# EAGLE design AK9753 Human Movement Sensor (EAGLE 7.7.0)
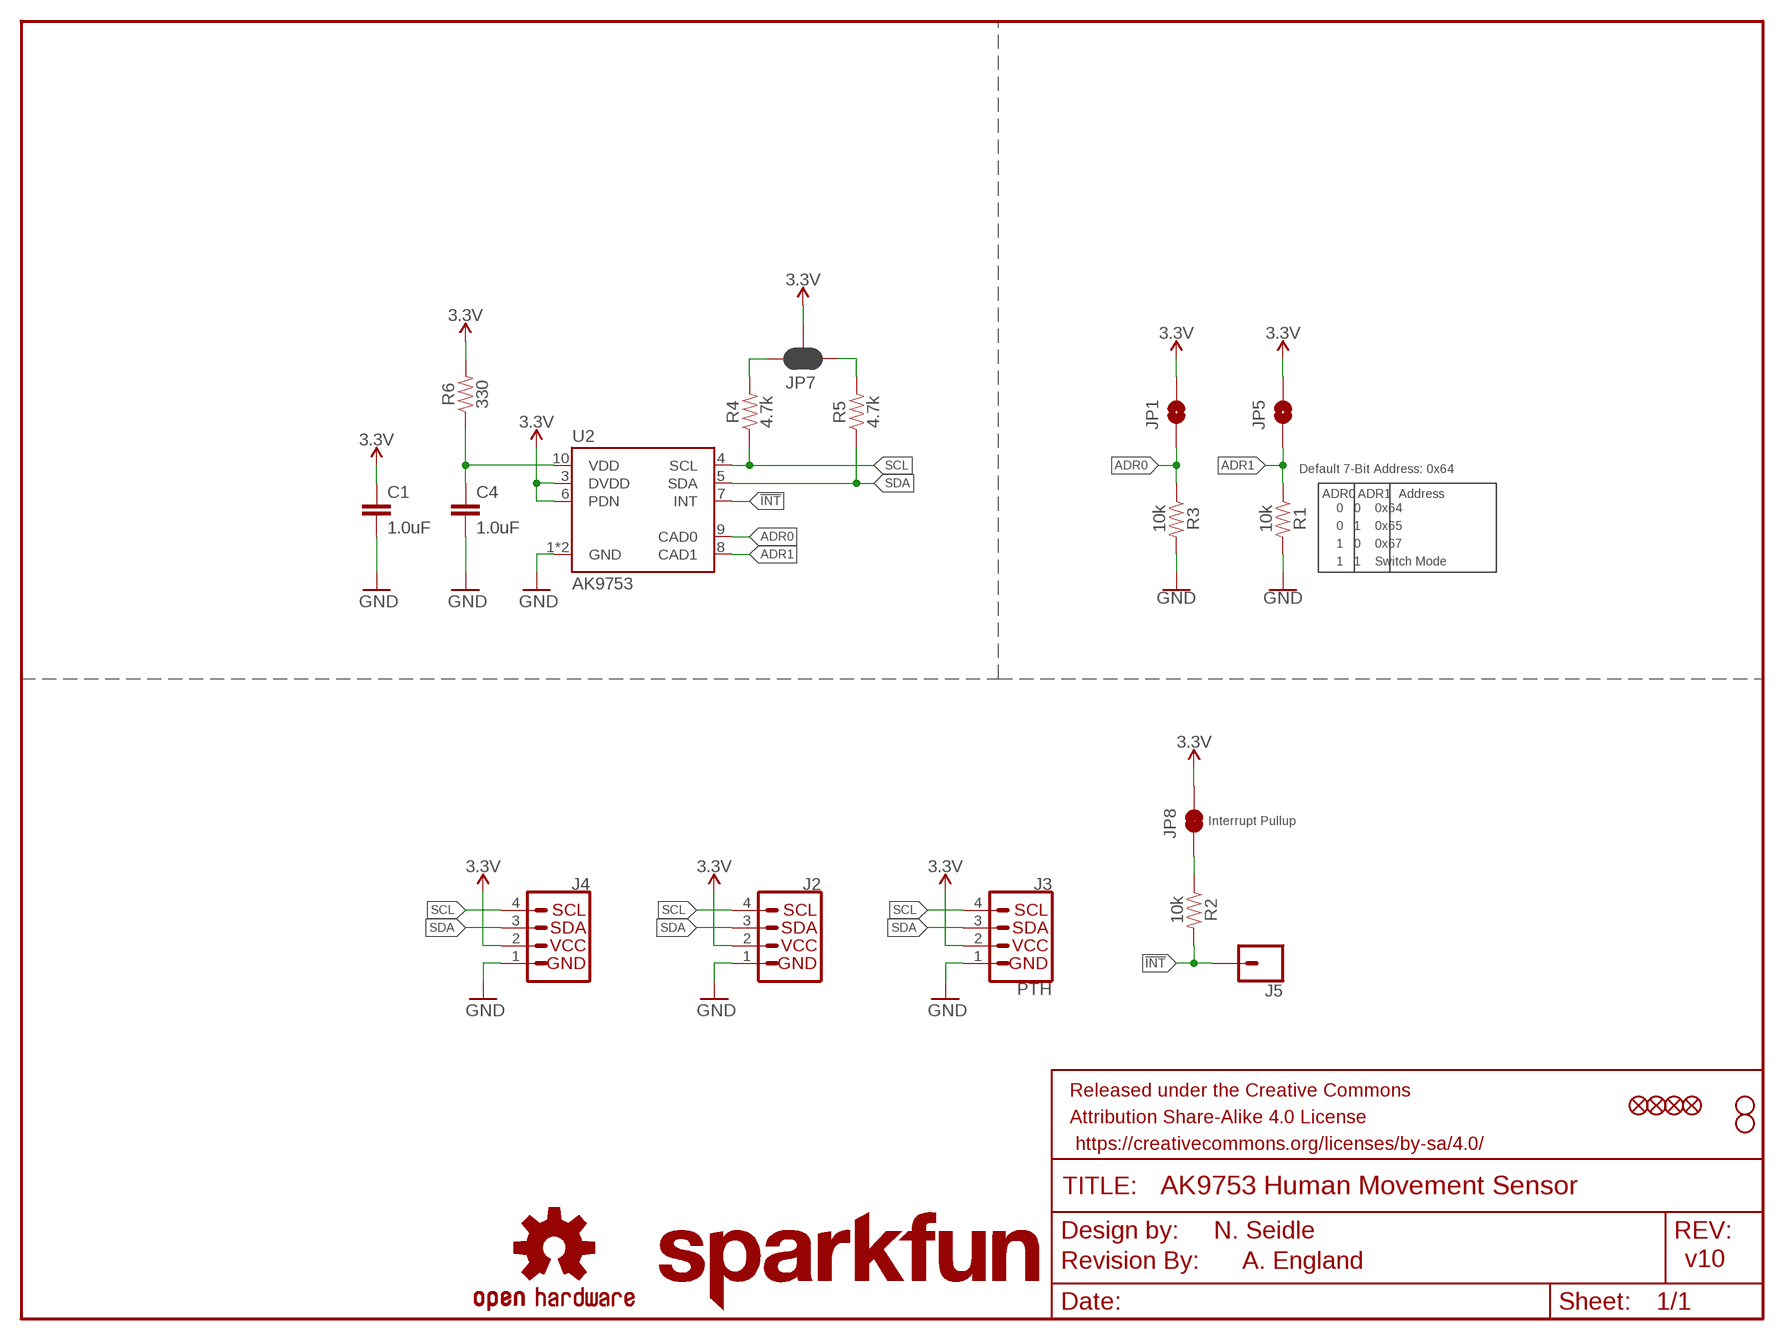
[diagram p0: schematic, sheet 1]

## Parts
C1  1.0uF  1.0UF-0603-16V-10%  [0603]
C4  1.0uF  1.0UF-0603-16V-10%  [0603]
FRAME1  FRAME-LETTER  [CREATIVE_COMMONS]
J2  QWIIC_CONNECTORJS-1MM  [1X04_1MM_RA]
J3  PTH  I2C_STANDARD_NO_SILK  [1X04_NO_SILK]
J4  QWIIC_CONNECTORJS-1MM  [1X04_1MM_RA]
J5  CONN_01PTH_NO_SILK_YES_STOP  [1X01_NO_SILK]
JP1  JUMPER-SMT_2_NO_SILK  [SMT-JUMPER_2_NO_SILK]
JP2  FIDUCIALUFIDUCIAL  [MICRO-FIDUCIAL]
JP3  STAND-OFF  [STAND-OFF]
JP4  STAND-OFF  [STAND-OFF]
JP5  JUMPER-SMT_2_NO_SILK  [SMT-JUMPER_2_NO_SILK]
JP6  FIDUCIALUFIDUCIAL  [MICRO-FIDUCIAL]
JP7  JUMPER-SMT_3_2-NC_PASTE_SILK  [SMT-JUMPER_3_2-NC_PASTE_SILK]
JP8  JUMPER-SMT_2_NC_TRACE_SILK  [SMT-JUMPER_2_NC_TRACE_SILK]
JP9  FIDUCIALUFIDUCIAL  [MICRO-FIDUCIAL]
JP10  FIDUCIALUFIDUCIAL  [MICRO-FIDUCIAL]
LOGO1  OSHW-LOGOMINI  [OSHW-LOGO-MINI]
LOGO2  SFE_LOGO_NAME.1_INCH  [SFE_LOGO_NAME_.1]
LOGO3  REVISION  [REVISION]
R1  10k  10KOHM-0603-1/10W-1%  [0603]
R2  10k  10KOHM-0603-1/10W-1%  [0603]
R3  10k  10KOHM-0603-1/10W-1%  [0603]
R4  4.7k  4.7KOHM-0603-1/10W-1%  [0603]
R5  4.7k  4.7KOHM-0603-1/10W-1%  [0603]
R6  330  330OHM-0603-1/10W-1%  [0603]
U2  AK9753  AK9750"  [SON10]

## Nets
3.3V: C1.1 J2.2 J3.2 J4.2 JP1.2 JP5.2 JP7.2 JP8.2 R6.2 U2.3(DVDD) U2.6(PDN)
!INT: J5.1 R2.2 U2.7(INT)
ADR0: JP1.1 R3.1 U2.9(CAD0)
ADR1: JP5.1 R1.1 U2.8(CAD1)
GND: C1.2 C4.2 J2.1 J3.1 J4.1 R1.2 R3.2 U2.1(GND) U2.2(GND)
N$1: JP7.1 R5.2
N$2: JP7.3 R4.2
N$3: JP8.1 R2.1
SCL: J2.4 J3.4 J4.4 R4.1 U2.4(SCL)
SDA: J2.3 J3.3 J4.3 R5.1 U2.5(SDA)
VDD: C4.1 R6.1 U2.10(VDD)

## Notes on the sheet
- Default 7-Bit Address: 0x64
- ADR0 | ADR1 | Address
- 0   0    0x64
- 0   1    0x65
- 1   0    0x67
- 1   1    Switch Mode
- Interrupt Pullup
- N. Seidle
- A. England | v10

## Library data of the parts
C1 C4 = SparkFun-Capacitors:1.0UF: 1µF ceramic capacitors A capacitor is a passive two-terminal electrical component used to store electrical energy temporarily in an electric field.; PROD_ID: CAP-00868
FRAME1 = SparkFun-Aesthetics:FRAME-LETTER: Schematic Frame - Letter Standard 8.5x11 US Letter frame
J2 J4 = SparkFun-Connectors:QWIIC_CONNECTOR: SparkFun I2C Standard Qwiic Connector An SMD 1mm pitch JST connector makes it easy and quick (get it? Qwiic?) to connect I2C devices to each other. The Qwiic system <http://www.sparkfun.com/qwiic> enables fast and solderless connection between popular platforms and various sensors and actuators. We carry 200mm <https://www.sparkfun.com/products/14204>, 100mm <https://www.sparkfun.com/products/14205>, 50mm <https://www.sparkfun.com/products/14206>, and breadboard friendly <https://www.sparkfun.com/products/14207> Qwiic cables. We also offer 10 pcs strips <https://www.sparkfun.com/products/14323> the SMD connectors.; PROD_ID: CONN-13694
J3 = SparkFun-Connectors:I2C_STANDARD: SparkFun I2C Standard Pinout Header SparkFun has standardized on a pinout for all I2C based sensor breakouts. This pinout allows I2C boards to be plugged directly into the headers on Arduino Uno compatible boards, and to be daisy chained easily. Example SparkFun Products: SparkFun Atmospheric Sensor Breakout - BME280 <https://www.sparkfun.com/products/13676> SparkFun Altitude/Pressure Sensor Breakout - MPL3115A2 <https://www.sparkfun.com/products/11084> SparkFun TOF Range Finder Sensor - VL6180 <https://www.sparkfun.com/products/12785>
J5 = SparkFun-Connectors:CONN_01: Single connection point. Often used as Generic Header-pin footprint for 0.1 inch spaced/style header connections On any of the 0.1 inch spaced packages, you can populate with these: Break Away Headers - Straight <https://www.sparkfun.com/products/116> (PRT-00116) Break Away Male Headers - Right Angle <https://www.sparkfun.com/products/553> (PRT-00553) Female Headers <https://www.sparkfun.com/products/115> (PRT-00115) Break Away Headers - Machine Pin <https://www.sparkfun.com/products/117> (PRT-00117) Break Away Female Headers - Swiss Machine Pin <https://www.sparkfun.com/products/743> (PRT-00743) This device is also useful as a general connection point to wire up your design to another part of your project. Our various solder wires solder well into these plated through hole pads. Hook-Up Wire - Assortment (Stranded, 22 AWG) <https://www.sparkfun.com/products/11375> (PRT-11375) Hook-Up Wire - Assortment (Solid Core, 22 AWG) <https://www.sparkfun.com/products/11367> (PRT-11367) View the entire wire category on our website here <https://www.sparkfun.com/categories/141> Special notes: SMTSO-256-ET is a "flush mount" nut for a 4-40 screw. We mostly use this on specialty testbeds; it is a nice way to connect hardware to your PCB at an adjustable hieght. Also note, the SNAP packages are for using a snappable style connector. We sell a baggie of snaps and they are also used on two LilyPad designs: Snap Assortment - 30 pack (male and female) <https://www.sparkfun.com/products/11347> (DEV-11347) LilyPad Arduino SimpleSnap <https://www.sparkfun.com/products/10941> (DEV-10941) LilyPad SimpleSnap Protoboard <https://www.sparkfun.com/products/10940> (DEV-10940)
JP1 JP5 = SparkFun-Jumpers:JUMPER-SMT_2_NO: Normally open jumper This jumper has two pads in close proximity to each other. Apply solder to close the connection. Round pads are easier to solder for beginners, but are a lot larger. SparkFun Product that uses the round pads: SparkFun EL Sequencer <https://www.sparkfun.com/products/12781>
JP2 JP6 JP9 JP10 = SparkFun:FIDUCIAL: Fiducial Alignment Points Various fiducial points for machine vision alignment.
JP3 JP4 = SparkFun:STAND-OFF: Stand Off This is the mechanical footprint for a #4 phillips button head screw. Use the keepout ring to avoid running the screw head into surrounding components. SKU : PRT-00447
JP7 = SparkFun-Jumpers:JUMPER-SMT_3_2-NC_PASTE: Normally closed solder jumper (2 of 2 connections) This jumper has an aperture in the stencil to allow solder paste to bridge both connections. Both connections are normally closed (NC). Wick off the solder to open the connection(s). Reapply solder to reclose the connection(s).
JP8 = SparkFun-Jumpers:JUMPER-SMT_2_NC_TRACE: Normally closed trace jumper This jumper has a trace between two pads so it's normally closed (NC). Use a razor knife to open the connection. For best results follow the IPC guidelines for cutting traces: Cutout at least 0.063 mm (0.005 in). Remove all loose material to clean up the cut area. Seal the cut with an approved epoxy. Reapply solder to reclose the connection.
LOGO1 = SparkFun-Aesthetics:OSHW-LOGO: Open-Source Hardware (OSHW) Logo This logo indicates the piece of hardware it is found on incorporates a OSHW license and/or adheres to the definition of open source hardware found here: http://freedomdefined.org/OSHW
LOGO2 = SparkFun-Aesthetics:SFE_LOGO_NAME: SparkFun Font Logo This is the SparkFun name logo. The logo on the schematic will always be the same size; the package variant is the height of the flame part of the logo (or the height the flame would be, if it were drawn). Default layer for the logo on the board is tSilk.
LOGO3 = SparkFun-Aesthetics:REVISION: "Revision By" Text Preceding text for revisor documentation. Includes schematic text on "symbols" layer, and board text on tDoc.
R1-R3 = SparkFun-Resistors:10KOHM: 10kΩ resistor A resistor is a passive two-terminal electrical component that implements electrical resistance as a circuit element. Resistors act to reduce current flow, and, at the same time, act to lower voltage levels within circuits. - Wikipedia; PROD_ID: RES-00824
R4 R5 = SparkFun-Resistors:4.7KOHM: 4.7kΩ resistor A resistor is a passive two-terminal electrical component that implements electrical resistance as a circuit element. Resistors act to reduce current flow, and, at the same time, act to lower voltage levels within circuits. - Wikipedia; PROD_ID: RES-07857
R6 = SparkFun-Resistors:330OHM: 330Ω resistor A resistor is a passive two-terminal electrical component that implements electrical resistance as a circuit element. Resistors act to reduce current flow, and, at the same time, act to lower voltage levels within circuits. - Wikipedia; PROD_ID: RES-00818
U2 = SparkFun-Sensors:AK9750: AK9750/AK9753 Human Movement Sensor; PROD_ID: SEN_13772

## Board
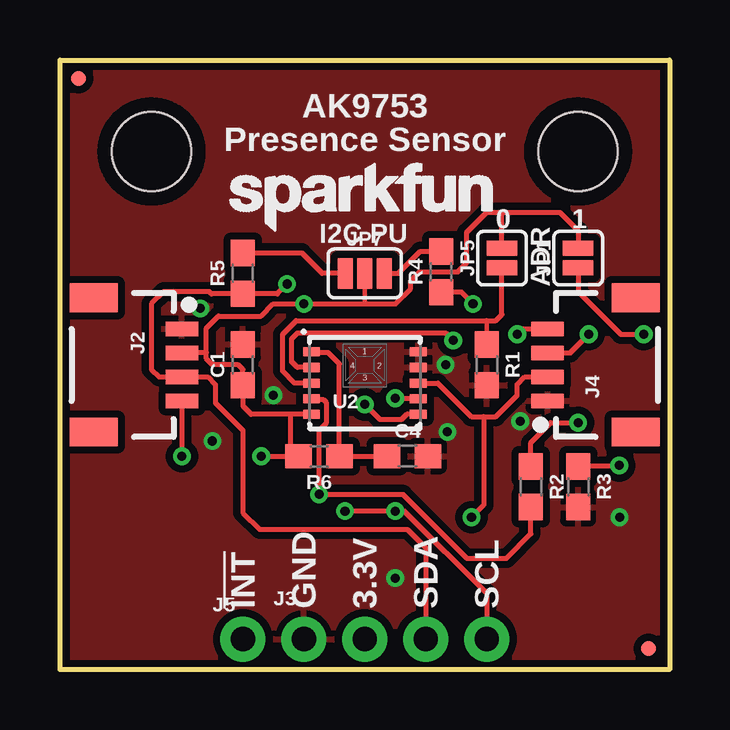
[diagram p1: board, top side]
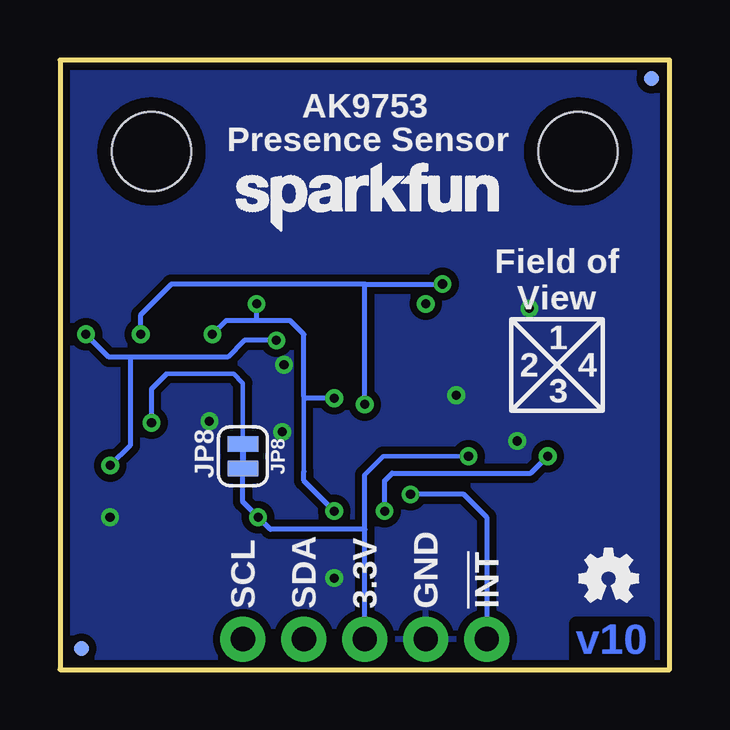
[diagram p2: board, bottom side, seen from below]

Size 25.4 x 25.4 mm. Coordinates in mm from the lower left corner, seen from the top.
Outline: 0,0 0,25.4 25.4,25.4 25.4,0 0,0
Copper layers (1*16): Top 0.035mm / dielectric 1.5mm / Bottom 0.035mm
Design rules "SparkFun-2-layer-TIGHT": minimum track width 7mil, minimum drill 15mil, track to track 7mil, track to pad 7mil, pad to pad 7mil, via to via 7mil, smd to smd 7mil, copper to edge 7mil, drill to drill 7mil, minimum pad ring 7mil, minimum via ring 7mil, stop-mask expansion 4mil, vias tented up to drill 25mil, thermal gap 10mil

### Footprints (pad centres in the part's own frame; a part is rotated, then mirrored left to right if it is on the bottom)
0603 = smd 1.1 x 1: 1 -0.85,0; 2 0.85,0
1X04_1MM_RA = smd 0.6 x 1.35: 1 -1.5,0; 2 -0.5,0; 3 0.5,0; 4 1.5,0 | smd 1.2 x 2: NC1 2.8,-3.675; NC2 -2.8,-3.675
1X04_NO_SILK = drill 1.016 pad 1.88: 1 0,0; 2 2.54,0; 3 5.08,0; 4 7.62,0
1X01_NO_SILK = drill 1.016 pad 1.88: 1 0,0
SMT-JUMPER_2_NO_SILK = smd 0.635 x 1.27: 1 -0.406,0; 2 0.406,0
MICRO-FIDUCIAL = smd 0.635 x 0.635: 1 0,0
STAND-OFF = hole 3.302: 0,0
SMT-JUMPER_3_2-NC_PASTE_SILK = smd 0.635 x 1.27: 1 -0.813,0; 2 0,0; 3 0.813,0
SMT-JUMPER_2_NC_TRACE_SILK = smd 0.635 x 1.27: 1 -0.508,0; 2 0.508,0
SON10 = smd 0.7 x 0.38: 1 2.225,1.3; 2 2.225,0.65; 3 2.225,0; 4 2.225,-0.65; 5 2.225,-1.3; 6 -2.225,-1.3; 7 -2.225,-0.65; 8 -2.225,0; 9 -2.225,0.65; 10 -2.225,1.3

### Placement (x,y rotation side)
C1  7.62,12.7 90 top
C4  14.48,8.89 0 top
FRAME1  -15.24,-17.78 0 top  (outside the outline)
J2  5.08,12.7 270 top
J3  10.16,1.27 0 top
J4  20.32,12.7 90 top
J5  7.62,1.27 0 top
JP1  21.59,17.14 90 top
JP2  24.51,0.89 0 top
JP3  3.81,21.59 0 top
JP4  21.59,21.59 0 top
JP5  18.41,17.14 90 top
JP6  0.76,24.64 0 top
JP7  12.7,16.51 0 top
JP8  17.78,8.89 270 bottom
JP9  0.76,24.64 0 bottom
JP10  24.51,0.89 0 bottom
LOGO1  2.54,3.81 0 bottom
LOGO2  6.6,17.78 0 top
LOGO3  -3.81,-20.32 0 top  (outside the outline)
R1  17.78,12.7 270 top
R2  19.62,7.62 270 top
R3  21.59,7.62 270 top
R4  15.88,16.57 90 top
R5  7.62,16.51 90 top
R6  10.79,8.89 180 top
U2  12.7,11.94 0 top
U$2  [SFE_LOGO_NAME_.1]  18.54,17.78 0 bottom

### Tracks (layer width: path | path; a pad name or v marks a point on that pad's centre or on a via)
3.3V  (via drill 0.38)
  Top 0.178: 9.59,9.25 R6.2 9.59,8.89 | 12.7,15.24 JP7.2
  Top 0.203: 6.1,13.21 6.1,14.22 6.6,14.73 8.38,14.73 8.89,15.24 v10.16,15.24 12.7,15.24 13.97,15.24 14.61,15.88 14.61,16.19 14.99,16.57 16.57,16.57 16.95,16.95 16.95,18.22 17.78,19.05 18.41,19.05 | 9.59,10.64 9.59,8.89 | U2.6 9.59,10.64 | 9.59,10.64 7.97,10.64 7.62,10.99 C1.1 7.62,12.51 7.43,12.7 6.35,12.7 6.1,12.95 6.1,13.21 | U2.3 15.75,11.94 17.14,10.54 17.65,10.54 | J4.2 19.37,12.19 19.05,11.87 19.05,11.43 18.16,10.54 17.65,10.54 | 17.65,10.54 17.65,6.86 v17.14,6.35 | 18.41,19.05 20.83,19.05 21.59,18.29 JP1.2 | JP5.2 18.41,19.05 | 6.1,13.21 6.09,13.2 J2.2 | v8.38,8.89 R6.2
  Bottom 0.178: 12.7,8.13 11.94,8.89 v8.38,8.89
  Bottom 0.203: J3.2 12.7,5.84 | 12.7,5.84 12.7,8.13 | JP8.2 17.78,6.99 v17.14,6.35 16.64,5.84 12.7,5.84
!INT  (via drill 0.38)
  Top 0.178: 10.52,11.24 U2.7
  Top 0.203: 10.52,11.24 10.99,11.24 11.11,11.11 11.11,10.29 10.79,9.97 v10.79,7.3 14.29,7.3 16.95,4.64 18.61,4.64 19.62,5.65 R2.2
  Bottom 0.203: J5.1 7.62,6.35 8.57,7.3 v10.79,7.3
ADR0  (via drill 0.38)
  Top 0.203: U2.9 9.89,12.59 9.65,12.83 9.65,13.78 9.91,14.03 15.68,14.03 16.07,14.03 v16.38,13.72 | JP1.1 21.59,15.75 23.37,13.97 v24.32,13.97 | v23.3,8.51 23.27,8.47 R3.1
  Bottom 0.203: v16.38,13.72 17.72,13.72 18.41,13.02 22.48,13.02 | 22.48,13.02 23.37,13.02 v24.32,13.97 | 22.48,13.02 22.48,9.34 v23.3,8.51
ADR1
  Top 0.178: 17.78,14.54 R1.1
  Top 0.203: U2.8 9.78,11.94 9.27,12.45 9.27,13.97 9.84,14.54 17.78,14.54 18.16,14.54 18.41,14.8 JP5.1
GND  (via drill 0.38)
  other vias: 8.89,11.43 19.18,10.35 16.14,9.91 23.32,6.35 16.07,12.7 13.97,3.81 5.84,15.05 6.35,9.53
  pour Bottom (isolate 0.305): 0,0 0,25.4 25.4,25.4 25.4,0
  pour Top (isolate 0.305): 0,0 0,25.4 25.4,25.4 25.4,0
N$1
  Top 0.203: JP7.1 10.92,16.51 10.07,17.36 R5.2
N$2
  Top 0.203: JP7.3 14.1,16.51 15.01,17.42 R4.2
N$3  (via drill 0.38)
  Top 0.203: R2.1 19.62,9.46 20.45,10.29 v21.59,10.29
  Bottom 0.178: JP8.1 17.78,11.94 18.16,12.32 20.95,12.32
  Bottom 0.203: 20.95,12.32 21.59,11.68 v21.59,10.29
SCL  (via drill 0.38)
  Top 0.178: 13.98,11.29 v13.97,11.3
  Top 0.203: U2.4 13.98,11.29 | v19.05,13.97 19.28,14.2 J4.4 | R4.1 16.73,15.72 v17.21,15.24 | J3.4 17.78,3.17 14.35,6.6 v13.97,6.6 v11.87,6.6 | J2.4 v5.08,8.89
  Bottom 0.178: 15.24,8.26 15.24,11.37 15.18,11.3
  Bottom 0.203: v13.97,11.3 15.18,11.3 | v19.05,13.97 18.48,14.54 17.14,14.54 | 15.24,11.37 15.24,13.97 15.81,14.54 17.14,14.54 | 17.14,14.54 17.21,14.61 v17.21,15.24 | v13.97,6.6 15.24,7.87 15.24,8.26 | v11.87,6.6 11.87,7.87 11.56,8.19 5.78,8.19 v5.08,8.89
SDA  (via drill 0.38)
  Top 0.203: U2.5 14.45,10.64 14.22,10.41 13.34,10.41 v12.7,11.05 | v9.46,16.07 9.06,15.66 R5.1 6.31,15.66 6.22,15.75 4.32,15.75 3.81,15.24 3.81,12.51 4.13,12.19 J2.3 6.15,12.2 6.48,11.87 6.48,11.11 7.62,9.97 7.62,6.54 8.32,5.84 14.48,5.84 15.24,5.08 J3.3 | J4.3 21.27,13.2 v22.04,13.97
  Bottom 0.203: v12.7,11.05 12.7,16.07 | 12.7,16.07 v9.46,16.07 | 12.7,16.07 20.77,16.07 22.04,14.8 v22.04,13.97
VDD
  Top 0.178: 10.51,13.21 U2.10
  Top 0.203: C4.1 R6.1 11.64,12.74 11.18,13.21 10.51,13.21

### Text on the board
Bottom: v10
tPlace: AK9753 | Presence Sensor | 0 | 1 | I2C PU | ADR | !INT | GND | 3.3V | SDA | SCL
bPlace: AK9753 | Presence Sensor | Field of / View | 1 | 4 | 2 | 3 | JP8 | !INT | GND | 3.3V | SDA | SCL
tDocu: N. Seidle | A. England